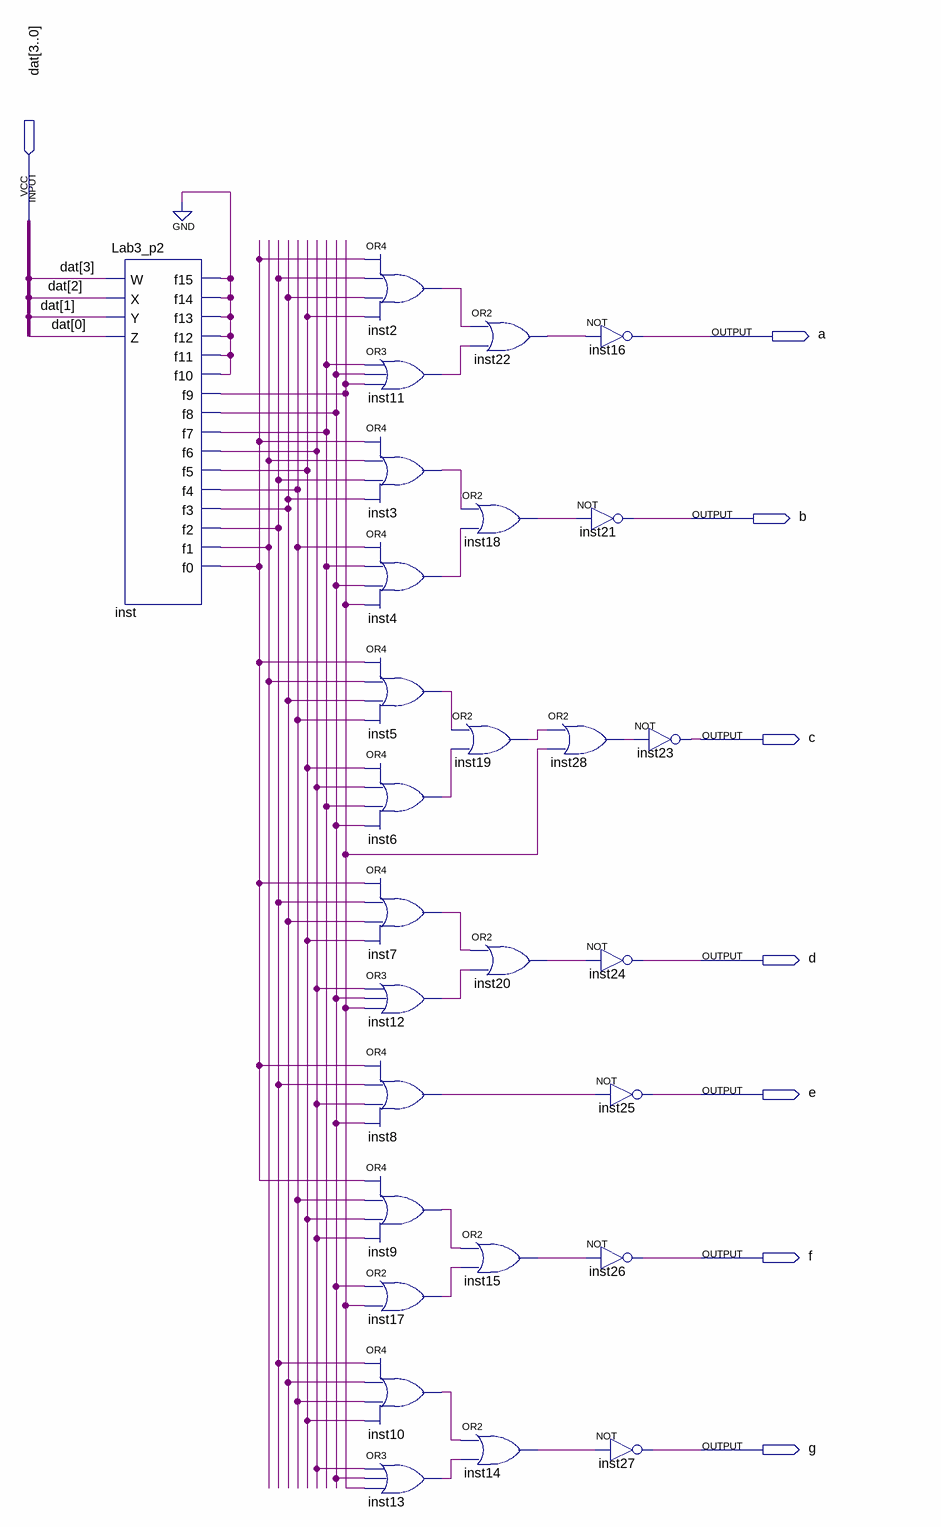
[diagram p0: schematic sheet]
// Quartus schematic lab6.bdf as structural Verilog: 28 symbols, 8 pins
module lab6 (
  input  [3:0] dat,
  output a,
  output b,
  output c,
  output d,
  output e,
  output f,
  output g
);

  wire inst2_out, inst3_out, inst4_out, inst5_out, inst6_out, inst7_out, inst8_out, inst9_out, inst10_out,
       inst11_out, inst12_out, inst13_out, inst14_out, inst15_out, inst17_out, inst18_out, inst19_out,
       inst20_out, inst22_out, inst28_out, inst_f0, inst_f1, inst_f2, inst_f3, inst_f4, inst_f5, inst_f6,
       inst_f7, inst_f8, inst_f9, inst_f15;

  Lab3_p2 inst (
    .W(dat[3]), .X(dat[2]), .Y(dat[1]), .Z(dat[0]), .f15(inst_f15), .f14(inst_f15), .f13(inst_f15),
    .f12(inst_f15), .f11(inst_f15), .f10(inst_f15), .f9(inst_f9), .f8(inst_f8), .f7(inst_f7), .f6(inst_f6),
    .f5(inst_f5), .f4(inst_f4), .f3(inst_f3), .f2(inst_f2), .f1(inst_f1), .f0(inst_f0));
  or inst2 (inst2_out, inst_f0, inst_f2, inst_f3, inst_f5);
  or inst11 (inst11_out, inst_f7, inst_f8, inst_f9);
  or inst3 (inst3_out, inst_f0, inst_f1, inst_f2, inst_f3);
  or inst4 (inst4_out, inst_f4, inst_f7, inst_f8, inst_f9);
  or inst5 (inst5_out, inst_f0, inst_f1, inst_f3, inst_f4);
  or inst6 (inst6_out, inst_f5, inst_f6, inst_f7, inst_f8);
  or inst7 (inst7_out, inst_f0, inst_f2, inst_f3, inst_f5);
  or inst12 (inst12_out, inst_f6, inst_f8, inst_f9);
  or inst8 (inst8_out, inst_f0, inst_f2, inst_f6, inst_f8);
  or inst9 (inst9_out, inst_f0, inst_f4, inst_f5, inst_f6);
  or inst17 (inst17_out, inst_f8, inst_f9);
  or inst10 (inst10_out, inst_f2, inst_f3, inst_f4, inst_f5);
  or inst13 (inst13_out, inst_f6, inst_f8, inst_f9);
  or inst22 (inst22_out, inst2_out, inst11_out);
  or inst18 (inst18_out, inst3_out, inst4_out);
  or inst19 (inst19_out, inst5_out, inst6_out);
  or inst20 (inst20_out, inst7_out, inst12_out);
  or inst15 (inst15_out, inst9_out, inst17_out);
  or inst14 (inst14_out, inst10_out, inst13_out);
  not inst16 (a, inst22_out);
  not inst21 (b, inst18_out);
  or inst28 (inst28_out, inst19_out, inst_f9);
  not inst24 (d, inst20_out);
  not inst26 (f, inst15_out);
  not inst23 (c, inst28_out);
  not inst25 (e, inst8_out);
  not inst27 (g, inst14_out);
  // also tied to GND on the sheet: inst_f15
endmodule
